# Altium schematic sheet optic_fiber.SchDoc
size A3
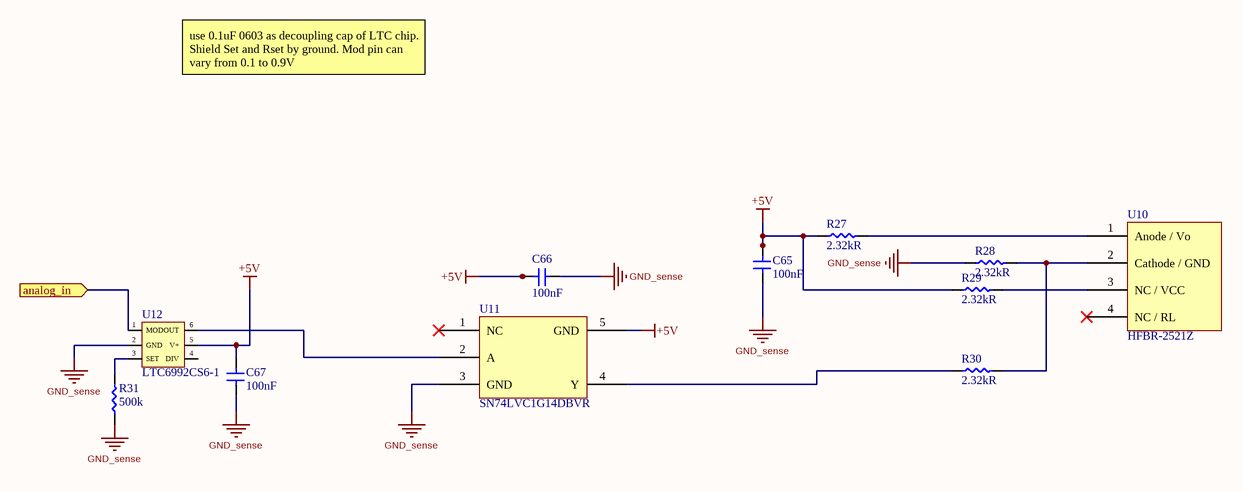
[diagram p0: optic_fiber.SchDoc]

## Parts
C65  100nF  [C0603]
C66  100nF  [C0603]
C67  100nF  [C0603]
R27  2.32kR  [R0603]
R28  2.32kR  [R0603]
R29  2.32kR  [R0603]
R30  2.32kR  [R0603]
R31  500k  [R0603]
U10  HFBR-2521Z  [HFBR]
U11  SN74LVC1G14DBVR  [SOT23-5]
U12  LTC6992CS6-1  [SOT23-6_proper]

## Ports
analog_in (in)

## Nets
+5V: C65.2 C66.2 C67.2 R27.1 R29.1 U11.5(GND) U12.5(V+)
GND_sense: C65.1 C66.1 C67.1 R28.1 R31.1 U11.3(GND) U12.2(GND)
analog_in: U12.1(MOD) ; port analog_in
NetR27_2: R27.2 U10.1(Anode_/_Vo)
NetR28_2: R28.2 R30.2 U10.2(Cathode_/_GND)
NetR29_2: R29.2 U10.3(NC_/_VCC)
NetR30_1: R30.1 U11.4(Y)
NetR31_2: R31.2 U12.3(SET)
NetU11_2: U11.2(A) U12.6(OUT)

Not connected (* = marked no-connect by the designer): U10 4(NC_/_RL)*; U11 1(NC)*; U12 4(DIV)

## Notes on the sheet
- use 0.1uF 0603 as decoupling cap of LTC chip. Shield Set and Rset by ground. Mod pin can vary from 0.1 to 0.9V

## Library data of the parts
C65-C67 = 06035G104ZAT2A: CAP CER 0.1UF 50V Y5V 0603; Manufacturer: Kyocera AVX; Dielectric Material: Ceramic; Tolerance: 80%; Supplier 1: Digi-Key; Manufacturer Part Number: 06035G104ZAT2A; Stock 1: 40000; Pricing 1: 1=0.11, 10=0.079, 100=0.0352, 500=0.02516, 1000=0.01977 (USD); Mount: PCB,Surface Mount; Case/Package: 0603; Number of Pins: 2; Case Code (Metric): 1608; Case Code (Imperial): 0603; Contact Plating: Matte,Tin; Min Operating Temperature: -30°C; Max Operating Temperature: 85°C; Capacitance: 100nF; Packaging: Tape and Reel; Voltage Rating: 50V; Package Quantity: 1; Voltage Rating (DC): 50V; Dielectric: Y5V; Termination: SMD/SMT; Voltage: 50V; Length: 1.6mm; Height: 0.63mm; Width: 0.032inch; Thickness: 0.035inch; Depth: 0.81mm; Radiation Hardening: No; REACH SVHC: No SVHC; Lead Free: Lead Free; ComponentLink1URL: http://www.avx.com/docs/Catalogs/cy5v.pdf; ComponentLink1Description: http://www.avx.com/docs/Catalogs/cy5v.pdf; ComponentLink2URL: http://www.farnell.com/datasheets/578190.pdf; ComponentLink2Description: http://www.farnell.com/datasheets/578190.pdf; ComponentLink3URL: http://catalogs.avx.com/SurfaceMount.pdf; ComponentLink3Description: http://catalogs.avx.com/SurfaceMount.pdf; Supplier Part Number 1: 478-3724-6-ND
R27-R30 = ERA-3AEB2321V: PANASONIC ELECTRONIC COMPONENTS         ERA3AEB2321V             SMD Chip Resistor, Thin Film, 2.32 kohm, 75 V, 0603 [1608 Metric], 100 mW,  0.1%; Power Rating: 100mW; Voltage Rating: 75V; Temperature Coefficient: 25ppm/°C; Supplier 1: Digi-Key; Manufacturer: Panasonic; Manufacturer Part Number: ERA-3AEB2321V; Stock 1: 27722; Pricing 1: 1=0.35, 10=0.3, 100=0.1172, 1000=0.04906, 2500=0.04498 (USD); Mount: Surface Mount; Case/Package: 0603; Number of Pins: 2; Case Code (Metric): 1608; Case Code (Imperial): 0603; Contact Plating: Tin; Min Operating Temperature: -55°C; Max Operating Temperature: 155°C; Resistance: 2.32kR; Tolerance: 0.1%; Packaging: Tape and Reel; Package Quantity: 5000; Composition: Metal Film,Thin Film; Number of Terminations: 2; Termination: SMD/SMT; Military Standard: Not; Max Power Dissipation: 100mW; Voltage Rating (DC): 75V; Length: 1.6mm; Height: 0.45mm; Width: 0.8mm; Depth: 0.8mm; Radiation Hardening: No; REACH SVHC: No SVHC; Lead Free: Lead Free; ComponentLink1URL: http://industrial.panasonic.com/www-data/pdf/AOA0000/AOA0000CE26.pdf; ComponentLink1Description: http://industrial.panasonic.com/www-data/pdf/AOA0000/AOA0000CE26.pdf; ComponentLink2URL: http://www.farnell.com/datasheets/2059650.pdf; ComponentLink2Description: http://www.farnell.com/datasheets/2059650.pdf; ComponentLink3URL: http://uk.rs-online.com/webdocs/0eb1/0900766b80eb1d8c.pdf; ComponentLink3Description: http://uk.rs-online.com/webdocs/0eb1/0900766b80eb1d8c.pdf; ComponentLink4URL: http://www.farnell.com/datasheets/485442.pdf; ComponentLink4Description: http://www.farnell.com/datasheets/485442.pdf; ComponentLink5URL: http://www.produktinfo.conrad.com/datenblaetter/1100000-1199999/001180821-da-01-en-WIDERSTAND_ERA_0603_2K32_0_1__5000ST.pdf; ComponentLink5Description: http://www.produktinfo.conrad.com/datenblaetter/1100000-1199999/001180821-da-01-en-WIDERSTAND_ERA_0603_2K32_0_1__5000ST.pdf; Supplier Part Number 1: P2.32KDBDKR-ND
R31 = ERA-3AEB2321V: PANASONIC ELECTRONIC COMPONENTS         ERA3AEB2321V             SMD Chip Resistor, Thin Film, 2.32 kohm, 75 V, 0603 [1608 Metric], 100 mW,  0.1%; Resistance: 2.32kR; Power Rating: 100mW; Voltage Rating: 75V; Temperature Coefficient: 25ppm/°C; Supplier 1: Digi-Key; Manufacturer: Panasonic; Manufacturer Part Number: ERA-3AEB2321V; Stock 1: 27722; Pricing 1: 1=0.35, 10=0.3, 100=0.1172, 1000=0.04906, 2500=0.04498 (USD); Mount: Surface Mount; Case/Package: 0603; Number of Pins: 2; Case Code (Metric): 1608; Case Code (Imperial): 0603; Contact Plating: Tin; Min Operating Temperature: -55°C; Max Operating Temperature: 155°C; Tolerance: 0.1%; Packaging: Tape and Reel; Package Quantity: 5000; Composition: Metal Film,Thin Film; Number of Terminations: 2; Termination: SMD/SMT; Military Standard: Not; Max Power Dissipation: 100mW; Voltage Rating (DC): 75V; Length: 1.6mm; Height: 0.45mm; Width: 0.8mm; Depth: 0.8mm; Radiation Hardening: No; REACH SVHC: No SVHC; Lead Free: Lead Free; ComponentLink1URL: http://industrial.panasonic.com/www-data/pdf/AOA0000/AOA0000CE26.pdf; ComponentLink1Description: http://industrial.panasonic.com/www-data/pdf/AOA0000/AOA0000CE26.pdf; ComponentLink2URL: http://www.farnell.com/datasheets/2059650.pdf; ComponentLink2Description: http://www.farnell.com/datasheets/2059650.pdf; ComponentLink3URL: http://uk.rs-online.com/webdocs/0eb1/0900766b80eb1d8c.pdf; ComponentLink3Description: http://uk.rs-online.com/webdocs/0eb1/0900766b80eb1d8c.pdf; ComponentLink4URL: http://www.farnell.com/datasheets/485442.pdf; ComponentLink4Description: http://www.farnell.com/datasheets/485442.pdf; ComponentLink5URL: http://www.produktinfo.conrad.com/datenblaetter/1100000-1199999/001180821-da-01-en-WIDERSTAND_ERA_0603_2K32_0_1__5000ST.pdf; ComponentLink5Description: http://www.produktinfo.conrad.com/datenblaetter/1100000-1199999/001180821-da-01-en-WIDERSTAND_ERA_0603_2K32_0_1__5000ST.pdf; Supplier Part Number 1: P2.32KDBDKR-ND
U10 = HFBR-2521Z: AVAGO TECHNOLOGIES   HFBR-2521Z   FIBRE OPTIC, RECEIVER, 5MBD; Manufacturer: Broadcom Avago; Wavelength: 660nm; Operating Supply Current: 10mA; Operating Supply Voltage: 5V; Max Output Current: 25mA; Rise Time: 80ns; Fall Time: 40ns; Max Supply Voltage: 7V; Min Supply Voltage: -500mV; Max Power Dissipation: 40mW; Data Rate: 115Kbps; Supplier 1: Digi-Key; Manufacturer Part Number: HFBR-2521Z; Stock 1: 1109; Pricing 1: 1=11.78, 10=10.666, 100=7.1104, 500=6.1105, 1000=5.7772 (USD); Mount: Through Hole; Number of Pins: 6; Min Operating Temperature: -40°C; Max Operating Temperature: 85°C; Packaging: Rail/Tube; Package Quantity: 200; Output Current: 25mA; Length: 18.8mm; Height: 7.6mm; Width: 12.2mm; Radiation Hardening: No; REACH SVHC: No SVHC; Lead Free: Lead Free; ComponentLink1URL: http://uk.rs-online.com/webdocs/0ad6/0900766b80ad66b3.pdf?src-supplier=RSComponents; ComponentLink1Description: http://uk.rs-online.com/webdocs/0ad6/0900766b80ad66b3.pdf?src-supplier=RSComponents; ComponentLink2URL: http://www.jameco.com/Jameco/Products/ProdDS/1584669.pdf?src-supplier=Jameco; ComponentLink2Description: http://www.jameco.com/Jameco/Products/ProdDS/1584669.pdf?src-supplier=Jameco; ComponentLink3URL: https://www.distrelec.biz/Web/Downloads/xx/_e/jrAVAGO-HFBRx5xx_e.pdf?mime=application%2Fpdf&src-supplier=Distrelec; ComponentLink3Description: https://www.distrelec.biz/Web/Downloads/xx/_e/jrAVAGO-HFBRx5xx_e.pdf?mime=application%2Fpdf&src-supplier=Distrelec; ComponentLink4URL: http://datasheet.iiic.cc/avago_technologies/HFBR-2521Z.pdf?src-supplier=IIIC; ComponentLink4Description: http://datasheet.iiic.cc/avago_technologies/HFBR-2521Z.pdf?src-supplier=IIIC; Supplier Part Number 1: 516-2062-ND
U11 = SN74LVC1G14DBVR: IC INVERTER SCHMITT 1CH SOT23-5; Manufacturer: Texas Instruments; Propagation Delay: 11ns; Max Supply Voltage: 5.5V; Min Supply Voltage: 1.65V; Number of Inputs: 1; Logic Function: Buffer,Inverter,Schmitt Trigger; Quiescent Current: 10uA; High Level Output Current: -32mA; Low Level Output Current: 32mA; Supplier 1: Digi-Key; Manufacturer Part Number: SN74LVC1G14DBVR; Stock 1: 42757; Pricing 1: 1=0.43, 10=0.32, 100=0.1996, 500=0.13658, 1000=0.10506 (USD); Mount: Surface Mount; Case/Package: SOT-23; Number of Pins: 5; Weight: 0.000557oz; Contact Plating: Tin,Matte; Min Operating Temperature: -40°C; Max Operating Temperature: 125°C; Packaging: Tape and Reel; Package Quantity: 3000; Number of Elements: 1; Number of Circuits: 1; Turn-On Delay Time: 11ns; Number of Gates: 1; Number of Bits: 1; Output Current: 32mA; Max Output Current: 32mA; Termination: SMD/SMT; Radiation Hardening: No; REACH SVHC: No SVHC; Lead Free: Lead Free; ComponentLink1URL: http://www.farnell.com/datasheets/1772446.pdf?src-supplier=Element14; ComponentLink1Description: http://www.farnell.com/datasheets/1772446.pdf?src-supplier=Element14; ComponentLink2URL: http://components.arrow.com/part/dataview/2374604S9714291N7713?src-supplier=Arrow; ComponentLink2Description: http://components.arrow.com/part/dataview/2374604S9714291N7713?src-supplier=Arrow; ComponentLink3URL: http://www.ti.com/lit/ds/symlink/sn74lvc1g14.pdf?src-supplier=Digi-Key; ComponentLink3Description: http://www.ti.com/lit/ds/symlink/sn74lvc1g14.pdf?src-supplier=Digi-Key; ComponentLink4URL: http://www.jameco.com/Jameco/Products/ProdDS/1044161.pdf?src-supplier=Jameco; ComponentLink4Description: http://www.jameco.com/Jameco/Products/ProdDS/1044161.pdf?src-supplier=Jameco; ComponentLink5URL: https://www.verical.com/server-webapp/html/getDatasheet?partID=204107&src-supplier=Verical; ComponentLink5Description: https://www.verical.com/server-webapp/html/getDatasheet?partID=204107&src-supplier=Verical; ComponentLink6URL: http://www.ti.com/general/docs/lit/getliterature.tsp?genericPartNumber=SN74LVC1G14&amp;&amp;fileType=pdf&src-supplier=Element14; ComponentLink6Description: http://www.ti.com/general/docs/lit/getliterature.tsp?genericPartNumber=SN74LVC1G14&amp;&amp;fileType=pdf&src-supplier=Element14; ComponentLink7URL: http://www.ti.com/general/docs/lit/getliterature.tsp?genericPartNumber=SN74LVC1G14&&fileType=pdf&src-supplier=Avnet; ComponentLink7Description: http://www.ti.com/general/docs/lit/getliterature.tsp?genericPartNumber=SN74LVC1G14&&fileType=pdf&src-supplier=Avnet; ComponentLink8URL: http://www.ti.com/general/docs/lit/getliterature.tsp?genericPartNumber=SN74LVC1G14&amp;&amp;fileType=pdf&src-supplier=Avnet+Asia; ComponentLink8Description: http://www.ti.com/general/docs/lit/getliterature.tsp?genericPartNumber=SN74LVC1G14&amp;&amp;fileType=pdf&src-supplier=Avnet+Asia; ComponentLink9URL: http://focus.ti.com/lit/ds/symlink/sn74lvc1g14.pdf?src-supplier=Avnet+Europe; ComponentLink9Description: http://focus.ti.com/lit/ds/symlink/sn74lvc1g14.pdf?src-supplier=Avnet+Europe; ComponentLink10URL: http://www.produktinfo.conrad.com/datenblaetter/1000000-1099999/001074513-da-01-en-IC_SCHMITT_SN74LVC1G14DBVR_SOT_23_5_TID.pdf?src-supplier=Conrad; ComponentLink10Description: http://www.produktinfo.conrad.com/datenblaetter/1000000-1099999/001074513-da-01-en-IC_SCHMITT_SN74LVC1G14DBVR_SOT_23_5_TID.pdf?src-supplier=Conrad; Supplier Part Number 1: 296-11607-1-ND
U12 = LTC6992CS6-1#TRMPBF: LINEAR TECHNOLOGY   LTC6992CS6-1#TRMPBF   PWM, VOLT CTRL, TIMERBLOX, 6SOT-23; Manufacturer: Analog Devices / Linear Technology; Frequency: 3.81Hz; Min Supply Voltage: 2.25V; Max Supply Voltage: 5.5V; Number of Timers/Counters: 1; Operating Supply Current: 365uA; Output Current: 20mA; Output Voltage: 5.15V; Supplier 1: Digi-Key; Manufacturer Part Number: LTC6992CS6-1#TRMPBF; Stock 1: 0; Pricing 1: 1=3.99, 25=2.6508, 100=2.1918, 250=2.08224 (USD); Mount: Surface Mount; Case/Package: TSOT; Number of Pins: 6; Min Operating Temperature: 0°C; Max Operating Temperature: 70°C; Package Quantity: 1; Packaging: Tape and Reel; Length: 2.9mm; Depth: 1.75mm; Radiation Hardening: No; REACH SVHC: No SVHC; ComponentLink1URL: http://www.linear.com/docs/29337?src-supplier=Digi-Key; ComponentLink1Description: http://www.linear.com/docs/29337?src-supplier=Digi-Key; ComponentLink2URL: http://www.farnell.com/datasheets/1642034.pdf?src-supplier=Element14; ComponentLink2Description: http://www.farnell.com/datasheets/1642034.pdf?src-supplier=Element14; ComponentLink3URL: http://www.farnell.com/datasheets/1642034.pdf?src-supplier=Farnell; ComponentLink3Description: http://www.farnell.com/datasheets/1642034.pdf?src-supplier=Farnell; ComponentLink4URL: https://www.verical.com/server-webapp/html/getDatasheet?partID=489617&src-supplier=Verical; ComponentLink4Description: https://www.verical.com/server-webapp/html/getDatasheet?partID=489617&src-supplier=Verical; ComponentLink5URL: http://www.produktinfo.conrad.com/datenblaetter/1200000-1299999/001253667-da-01-en-IC_OSC_LTC6992CS6_1_TRMPBF_TSOT_23_6_LTC.pdf?src-supplier=Conrad; ComponentLink5Description: http://www.produktinfo.conrad.com/datenblaetter/1200000-1299999/001253667-da-01-en-IC_OSC_LTC6992CS6_1_TRMPBF_TSOT_23_6_LTC.pdf?src-supplier=Conrad; Supplier Part Number 1: LTC6992CS6-1#TRMPBFDKR-ND